# EAGLE schematic BCN3D electronics (EAGLE 7.5.0)
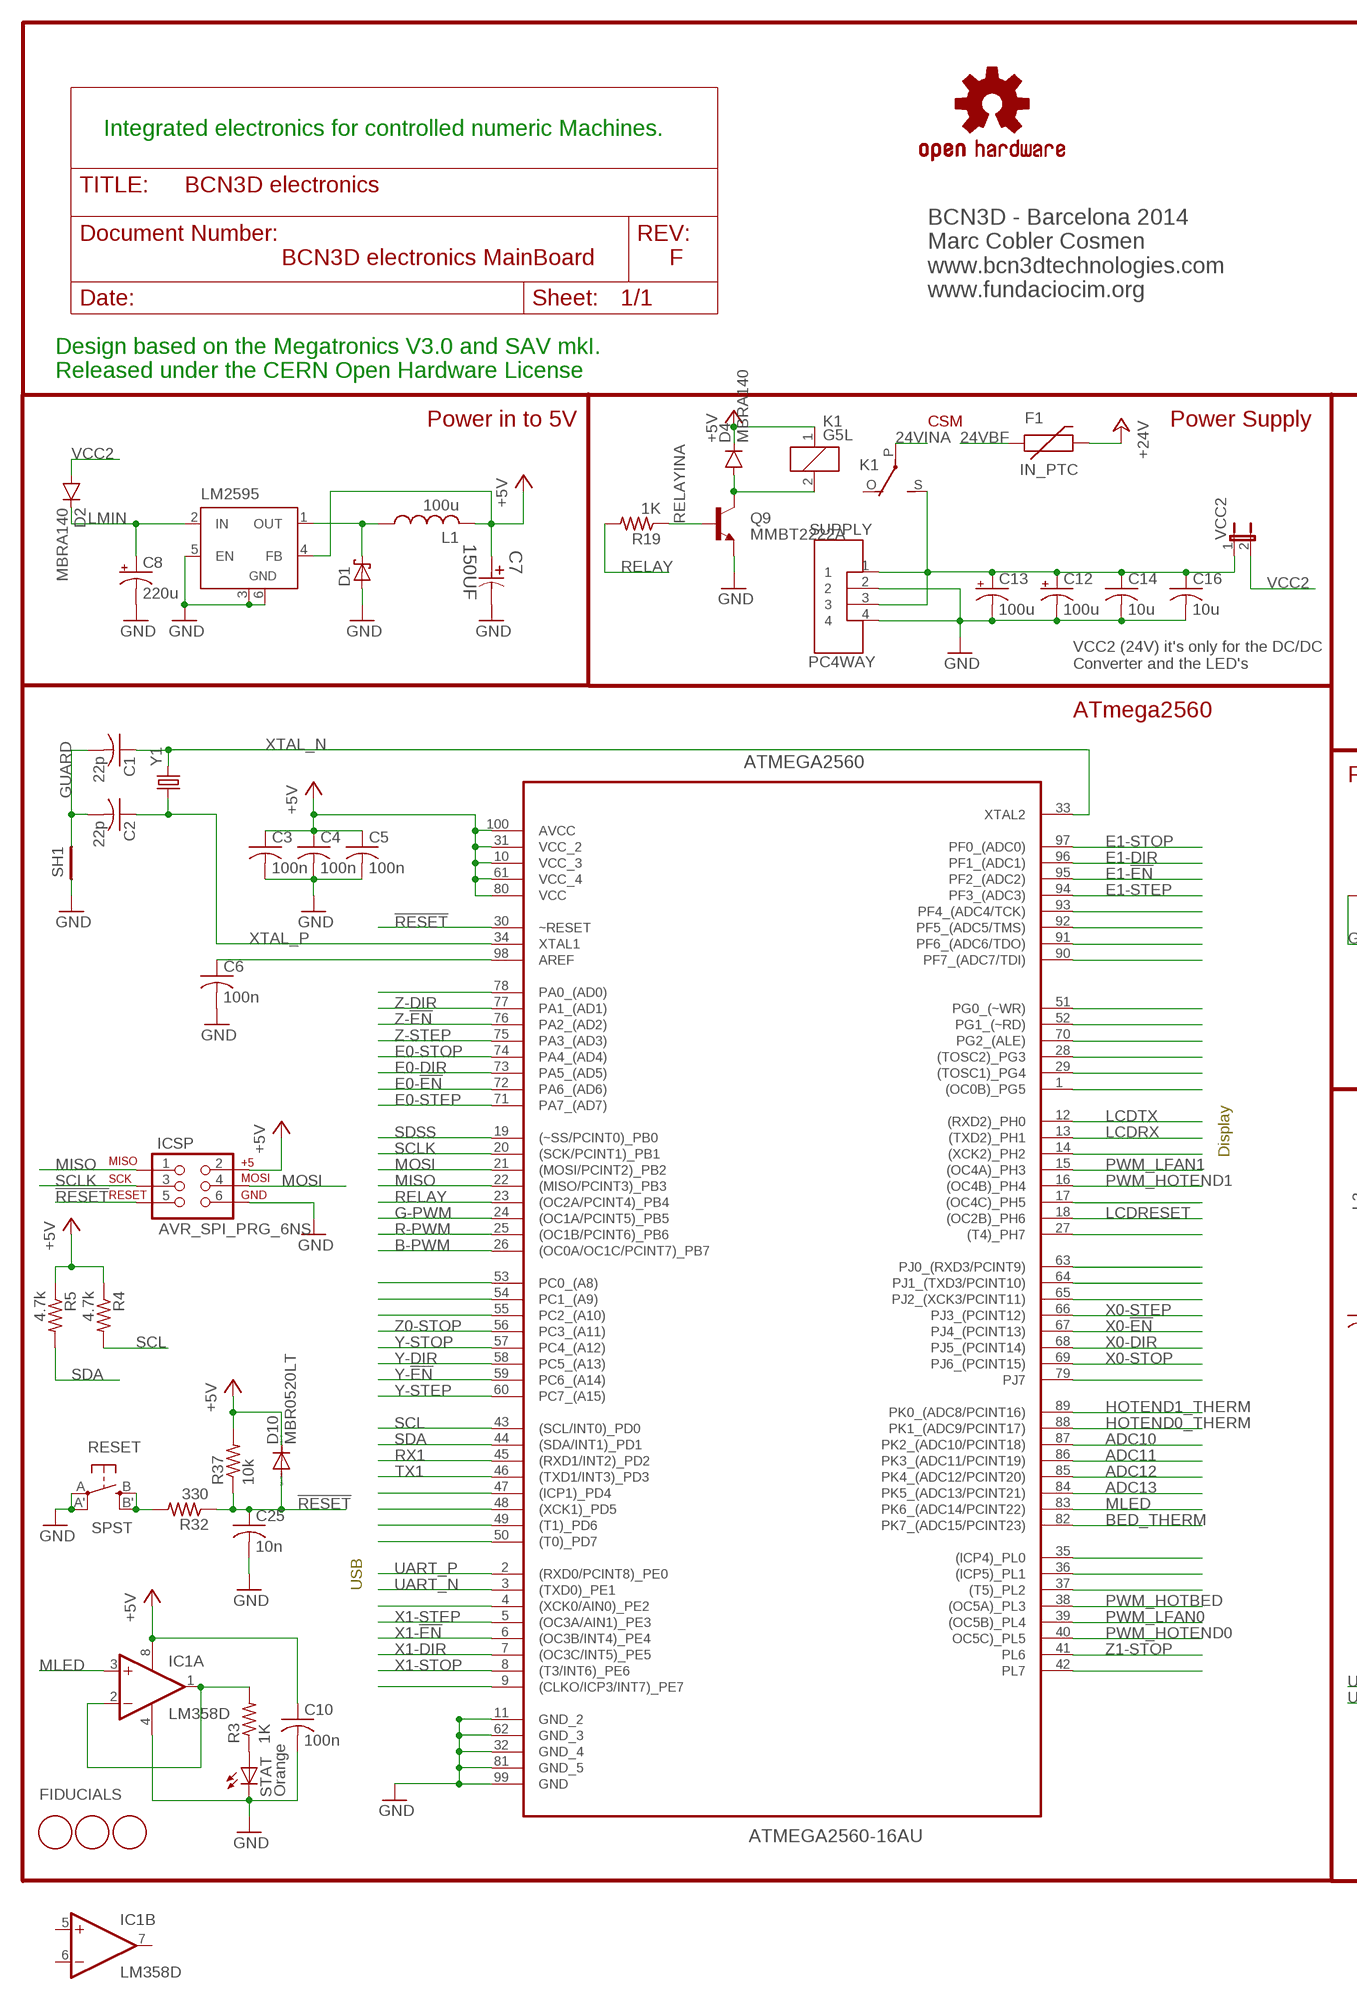
[diagram p0: schematic, sheet 1, part 1 of 2]
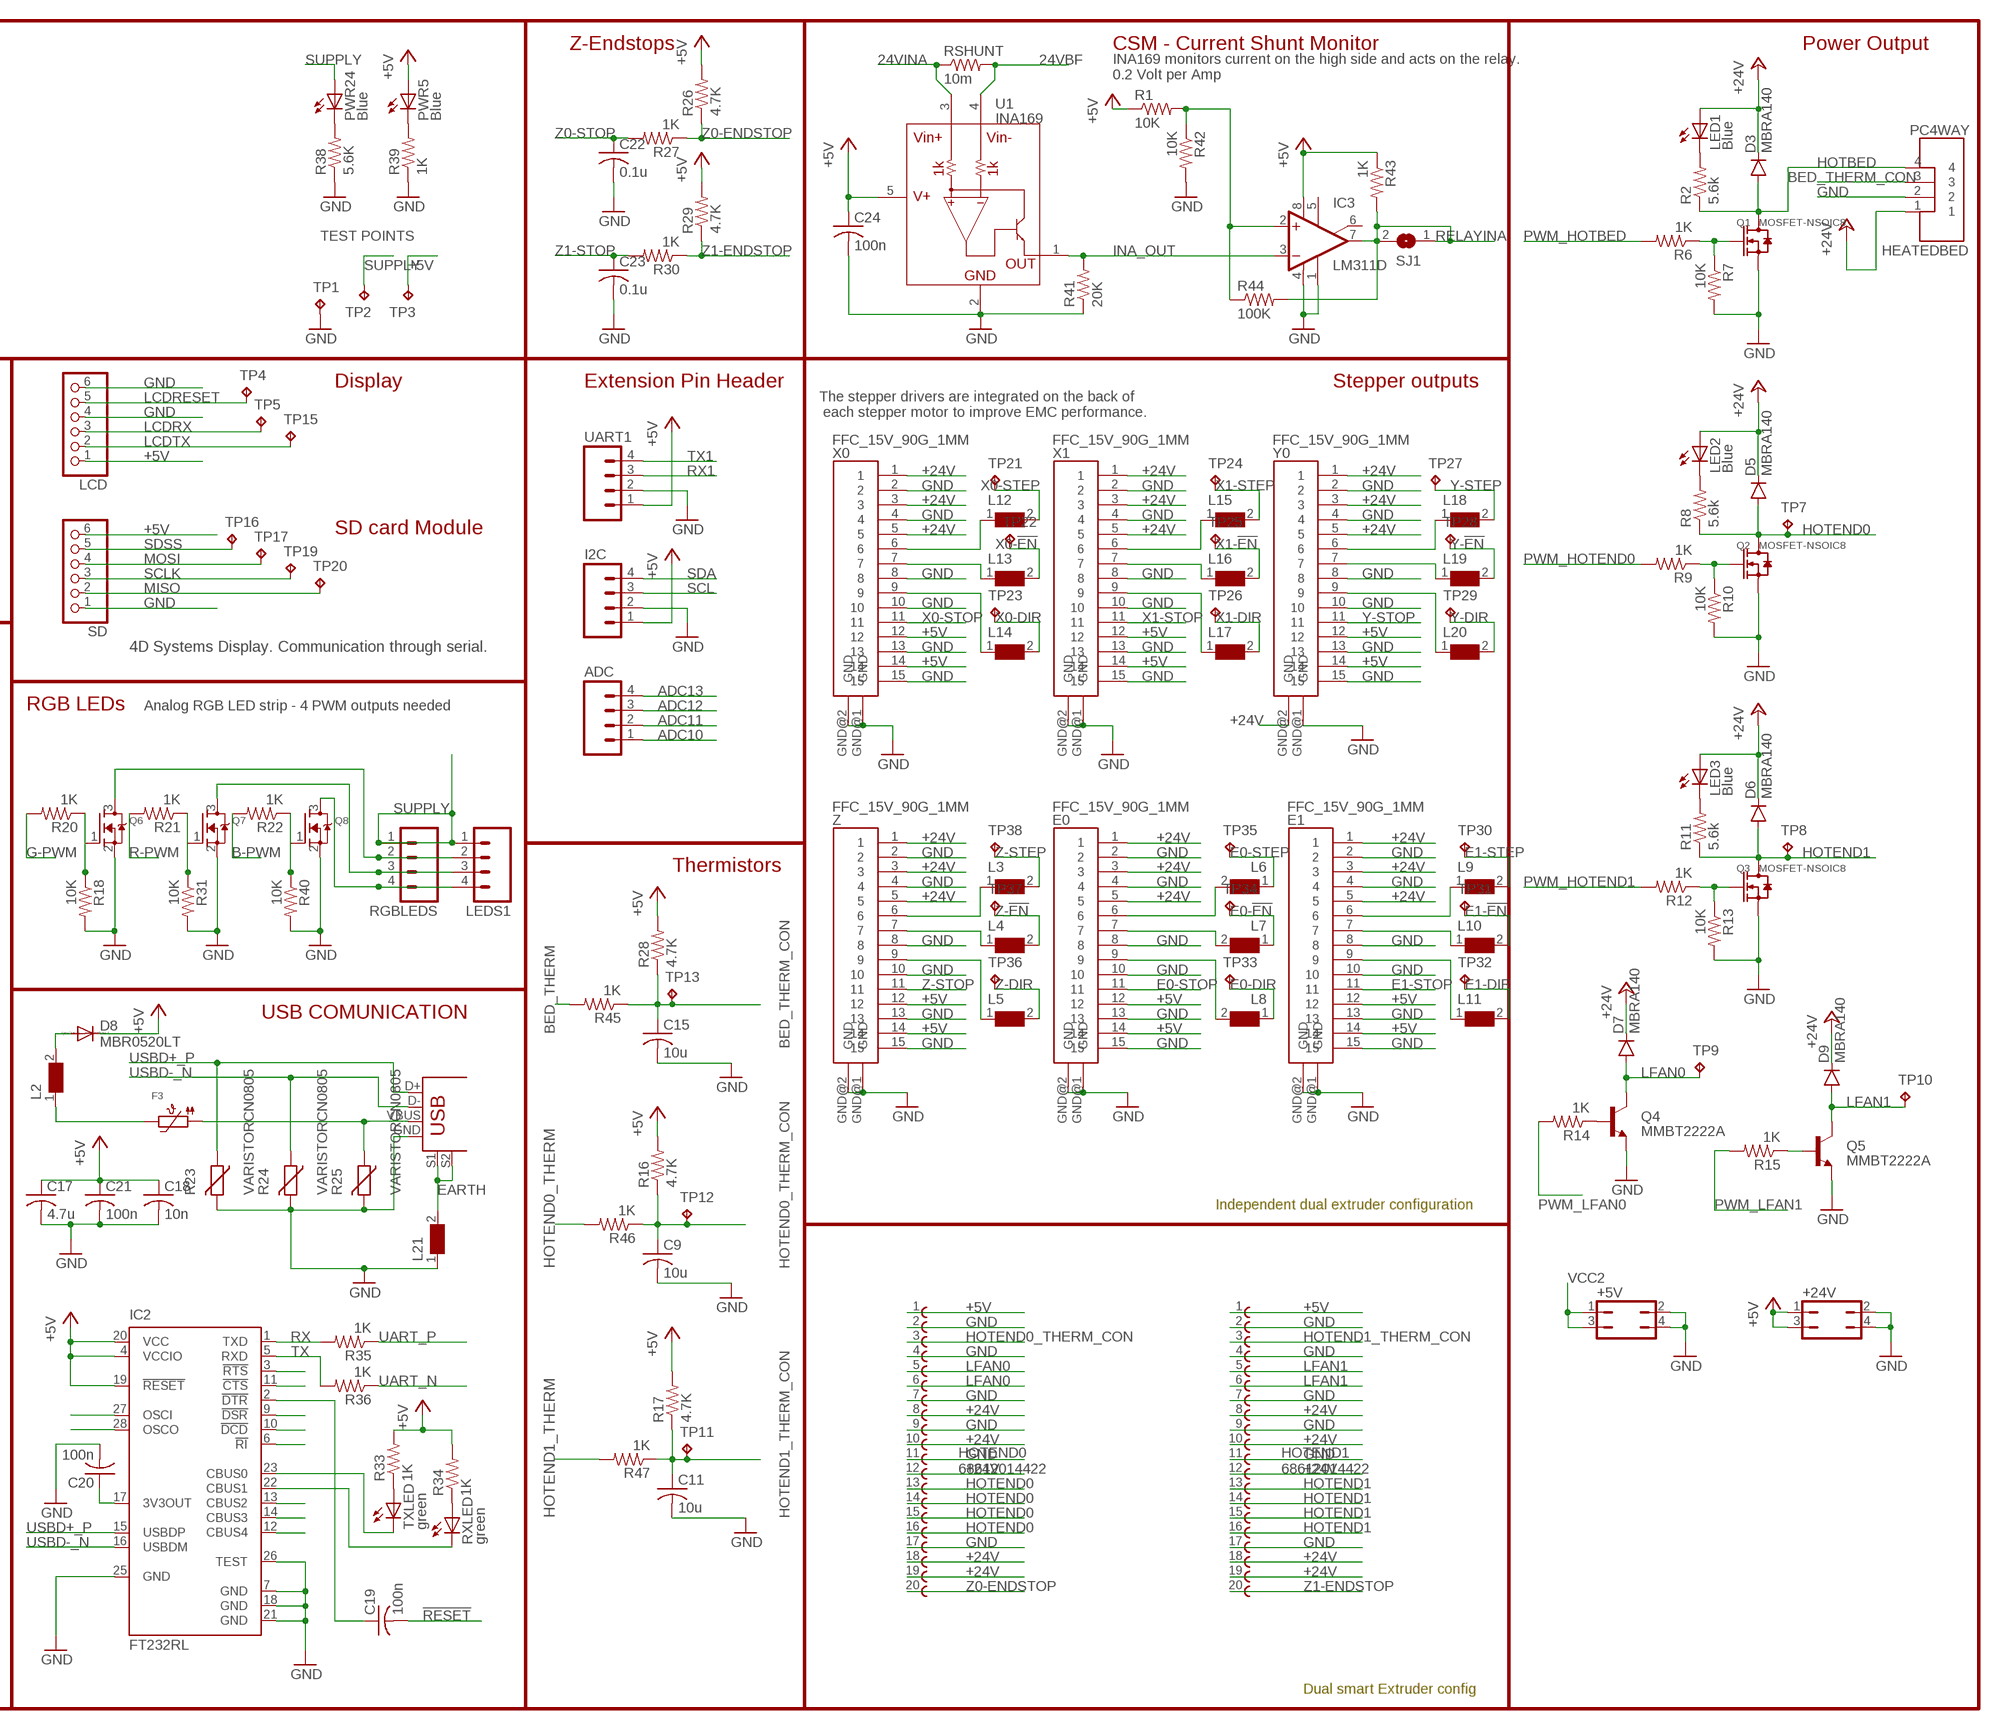
[diagram p1: schematic, sheet 1, part 2 of 2]

## Parts
+5V  JP2Q  [JP2Q]
+24V  JP2Q  [JP2Q]
ADC  M04PTH  [1X04]
ATMEGA2560  ATMEGA2560-16AU  [QFP50P1600X1600X120-100N]
C1  22p  C-USC0805  [C0805]
C2  22p  C-USC0805  [C0805]
C3  100n  C-USC0805  [C0805]
C4  100n  C-USC0805  [C0805]
C5  100n  C-USC0805  [C0805]
C6  100n  C-USC0805  [C0805]
C7  150UF  EEE-FK0J221P-CASE-D  [CAPAE660X610N]
C8  220u  CPOL-USUD-8X10  [UD-8X10_NICHICON]
C9  10u  C-USC0805  [C0805]
C10  100n  C-USC0805  [C0805]
C11  10u  C-USC0805  [C0805]
C12  100u  CPOL-USUD-8X10  [UD-8X10_NICHICON]
C13  100u  CPOL-USUD-8X10  [UD-8X10_NICHICON]
C14  10u  C-USC1210K  [C1210K]
C15  10u  C-USC0805  [C0805]
C16  10u  C-USC1210K  [C1210K]
C17  4.7u  C-USC0805  [C0805]
C18  10n  C-USC0805  [C0805]
C19  100n  C-USC0805  [C0805]
C20  100n  C-USC0805  [C0805]
C21  100n  C-USC0805  [C0805]
C22  0.1u  C-USC0805  [C0805]
C23  0.1u  C-USC0805  [C0805]
C24  100n  C-USC0805  [C0805]
C25  10n  C-USC0805  [C0805]
D1  SCHOTTKY-DIODESMC  [SMC]
D2  MBRA140  DIODESMA  [SMA-DIODE]
D3  MBRA140  DIODESMA  [SMA-DIODE]
D4  MBRA140  DIODESMA  [SMA-DIODE]
D5  MBRA140  DIODESMA  [SMA-DIODE]
D6  MBRA140  DIODESMA  [SMA-DIODE]
D7  MBRA140  DIODESMA  [SMA-DIODE]
D8  MBR0520LT  [SOD123]
D9  MBRA140  DIODESMA  [SMA-DIODE]
D10  MBR0520LT  [SOD123]
E0  FFC_15V_90G_1MM  [TE_FFC_CON1MM]
E1  FFC_15V_90G_1MM  [TE_FFC_CON1MM]
F1  IN_PTC  PTCSMD  [PTC-1206]
F3  MICROBUILDER_PTC1206_L  [MICROBUILDER_1206_PTC]
FID1  FIDUCIAL  [FIDUCIAL_1MM]
FID2  FIDUCIAL  [FIDUCIAL_1MM]
FID3  FIDUCIAL  [FIDUCIAL_1MM]
HEATEDBED  PC4WAY  POWER_CONNECTOR_4WAY  [MOLEX_MINIFIT-JR]
HOTEND0  68612014422  [68612014422]
HOTEND1  68612014422  [68612014422]
I2C  M04PTH  [1X04]
IC1  LM358D  [SO08]
IC2  FT232RL  [SSOP28]
IC3  LM311D  [SO08]
ICSP  AVR_SPI_PRG_6NS  [2X3-NS]
K1  G5L  [G5LE]
L1  100u  INDUCTANCE  [SSR1260]
L2  WE-CBF_0805  [0805]
L3  WE-CBF_0805  [0805]
L4  WE-CBF_0805  [0805]
L5  WE-CBF_0805  [0805]
L6  WE-CBF_0805  [0805]
L7  WE-CBF_0805  [0805]
L8  WE-CBF_0805  [0805]
L9  WE-CBF_0805  [0805]
L10  WE-CBF_0805  [0805]
L11  WE-CBF_0805  [0805]
L12  WE-CBF_0805  [0805]
L13  WE-CBF_0805  [0805]
L14  WE-CBF_0805  [0805]
L15  WE-CBF_0805  [0805]
L16  WE-CBF_0805  [0805]
L17  WE-CBF_0805  [0805]
L18  WE-CBF_0805  [0805]
L19  WE-CBF_0805  [0805]
L20  WE-CBF_0805  [0805]
L21  WE-CBF_0805  [0805]
LCD  PINHD-1X6  [1X06]
LED1  Blue  LEDCHIPLED_0805  [CHIPLED_0805]
LED2  Blue  LEDCHIPLED_0805  [CHIPLED_0805]
LED3  Blue  LEDCHIPLED_0805  [CHIPLED_0805]
LEDS1  M04PTH  [1X04]
LM2595  LM2595  [TO263-5]
LOGO1  OSHW-LOGOM  [OSHW-LOGO-M]
PWR5  Blue  LEDCHIPLED_0805  [CHIPLED_0805]
PWR24  Blue  LEDCHIPLED_0805  [CHIPLED_0805]
Q1  MOSFET-NSOIC8  [SOIC8]
Q2  MOSFET-NSOIC8  [SOIC8]
Q3  MOSFET-NSOIC8  [SOIC8]
Q4  MMBT2222A  TRANSISTOR_NPNMMBT2222A  [SOT23-3]
Q5  MMBT2222A  TRANSISTOR_NPNMMBT2222A  [SOT23-3]
Q6  MOSFET-NREFLOW  [SOT23]
Q7  MOSFET-NREFLOW  [SOT23]
Q8  MOSFET-NREFLOW  [SOT23]
Q9  MMBT2222A  TRANSISTOR_NPNMMBT2222A  [SOT23-3]
R1  10K  R-US_M0805  [M0805]
R2  5.6k  R-US_M0805  [M0805]
R3  1K  R-US_R0805  [R0805]
R4  4.7k  R-US_M0805  [M0805]
R5  4.7k  R-US_M0805  [M0805]
R6  1K  R-US_M0805  [M0805]
R7  10K  R-US_M0805  [M0805]
R8  5.6k  R-US_M0805  [M0805]
R9  1K  R-US_M0805  [M0805]
R10  10K  R-US_M0805  [M0805]
R11  5.6k  R-US_M0805  [M0805]
R12  1K  R-US_M0805  [M0805]
R13  10K  R-US_M0805  [M0805]
R14  1K  R-US_M0805  [M0805]
R15  1K  R-US_M0805  [M0805]
R16  4.7K  R-US_M0805  [M0805]
R17  4.7K  R-US_M0805  [M0805]
R18  10K  R-US_M0805  [M0805]
R19  1K  R-US_M0805  [M0805]
R20  1K  R-US_M0805  [M0805]
R21  1K  R-US_M0805  [M0805]
R22  1K  R-US_M0805  [M0805]
R23  VARISTORCN0805  [CT/CN0805]
R24  VARISTORCN0805  [CT/CN0805]
R25  VARISTORCN0805  [CT/CN0805]
R26  4.7K  R-US_M0805  [M0805]
R27  1K  R-US_M0805  [M0805]
R28  4.7K  R-US_M0805  [M0805]
R29  4.7K  R-US_M0805  [M0805]
R30  1K  R-US_M0805  [M0805]
R31  10K  R-US_M0805  [M0805]
R32  330  R-US_M0805  [M0805]
R33  1K  R-US_M0805  [M0805]
R34  1K  R-US_M0805  [M0805]
R35  1K  R-US_M0805  [M0805]
R36  1K  R-US_M0805  [M0805]
R37  10k  R-US_M0805  [M0805]
R38  5.6K  R-US_R0805  [R0805]
R39  1K  R-US_R0805  [R0805]
R40  10K  R-US_M0805  [M0805]
R41  20K  R-US_M0805  [M0805]
R42  10K  R-US_M0805  [M0805]
R43  1K  R-US_M0805  [M0805]
R44  100K  R-US_M0805  [M0805]
R45  1K  R-US_M0805  [M0805]
R46  1K  R-US_M0805  [M0805]
R47  1K  R-US_M0805  [M0805]
RESET  SPST  SPST_TACT-EVQQ2  [EVQ-Q2]
RGBLEDS  M04PTH  [1X04]
RSHUNT  10m  RESISTOR2512  [R2512]
RXLED  green  LEDCHIPLED_0805  [CHIPLED_0805]
SD  PINHD-1X6  [1X06]
SH1  SHORTT5  [SHORT_TOP-50]
SJ1  SJ  [SJ]
STAT  Orange  LEDCHIP-LED0805  [CHIP-LED0805]
SUPPLY  PC4WAY  POWER_CONNECTOR_4WAY  [MOLEX_MINIFIT-JR]
TP1  TPB2,54  [B2,54]
TP2  TPB2,54  [B2,54]
TP3  TPB2,54  [B2,54]
TP4  TPB2,54  [B2,54]
TP5  TPB2,54  [B2,54]
TP7  TPB2,54  [B2,54]
TP8  TPB2,54  [B2,54]
TP9  TPB2,54  [B2,54]
TP10  TPB2,54  [B2,54]
TP11  TPB2,54  [B2,54]
TP12  TPB2,54  [B2,54]
TP13  TPB2,54  [B2,54]
TP15  TPB2,54  [B2,54]
TP16  TPB2,54  [B2,54]
TP17  TPB2,54  [B2,54]
TP19  TPB2,54  [B2,54]
TP20  TPB2,54  [B2,54]
TP21  TPB2,54  [B2,54]
TP22  TPB2,54  [B2,54]
TP23  TPB2,54  [B2,54]
TP24  TPB2,54  [B2,54]
TP25  TPB2,54  [B2,54]
TP26  TPB2,54  [B2,54]
TP27  TPB2,54  [B2,54]
TP28  TPB2,54  [B2,54]
TP29  TPB2,54  [B2,54]
TP30  TPB2,54  [B2,54]
TP31  TPB2,54  [B2,54]
TP32  TPB2,54  [B2,54]
TP33  TPB2,54  [B2,54]
TP34  TPB2,54  [B2,54]
TP35  TPB2,54  [B2,54]
TP36  TPB2,54  [B2,54]
TP37  TPB2,54  [B2,54]
TP38  TPB2,54  [B2,54]
TXLED  green  LEDCHIPLED_0805  [CHIPLED_0805]
U1  INA169  [SOT23-5]
U$6  USB+SHIELD  [USB-B-PTH]
UART1  M04PTH  [1X04]
VCC2  JP1E  [JP1]
X0  FFC_15V_90G_1MM  [TE_FFC_CON1MM]
X1  FFC_15V_90G_1MM  [TE_FFC_CON1MM]
Y0  FFC_15V_90G_1MM  [TE_FFC_CON1MM]
Y1  CRYSTALHC49US  [HC49US]
Z  FFC_15V_90G_1MM  [TE_FFC_CON1MM]

## Nets
24VBF: F1.1 RSHUNT.2 U1.4(VIN-)
24VINA: K1.P(2:P) RSHUNT.1 U1.3(VIN+)
!RESET: ATMEGA2560.30(~RESET) C19.2 C25.1 D10.A ICSP.5 R32.1 R37.1
+5V: +24V.1 +24V.3 ATMEGA2560.10(VCC_3) ATMEGA2560.31(VCC_2) ATMEGA2560.61(VCC_4) ATMEGA2560.80(VCC) ATMEGA2560.100(AVCC) C3.1 C4.1 C5.1 C7.1 C10.1 C17.1 C18.1 C21.1 C24.1 D4.C D8.C D10.C E0.12 E0.14 E1.12 E1.14 HOTEND0.1 HOTEND1.1 I2C.1 IC1.8(P:V+) IC2.4(VCCIO) IC2.19(!RESET) IC2.20(VCC) IC3.8(V+) ICSP.2 K1.1 L1.B LCD.1 LM2595.4(FB) PWR5.A R1.1 R4.1 R5.1 R16.2 R17.2 R26.2 R28.2 R29.2 R33.2 R34.2 R37.2 R43.1 SD.6 TP3.TP U1.5(V+) UART1.1 X0.12 X0.14 X1.12 X1.14 Y0.12 Y0.14 Z.12 Z.14
+24V: D3.C D5.C D6.C D7.C D9.C E0.1 E0.3 E0.5 E1.1 E1.3 E1.5 F1.2 HEATEDBED.1 HOTEND0.8 HOTEND0.10 HOTEND0.12 HOTEND0.18 HOTEND0.19 HOTEND1.8 HOTEND1.10 HOTEND1.12 HOTEND1.18 HOTEND1.19 LED1.A LED2.A LED3.A X0.1 X0.3 X0.5 X1.1 X1.3 X1.5 Y0.1 Y0.3 Y0.5 Y0.GND@2(GND) Z.1 Z.3 Z.5
ADC10: ADC.1 ATMEGA2560.87(PK2_(ADC10/PCINT18))
ADC11: ADC.2 ATMEGA2560.86(PK3_(ADC11/PCINT19))
ADC12: ADC.3 ATMEGA2560.85(PK4_(ADC12/PCINT20))
ADC13: ADC.4 ATMEGA2560.84(PK5_(ADC13/PCINT21))
B-PWM: ATMEGA2560.26((OC0A/OC1C/PCINT7)_PB7) R22.2
BED_THERM: ATMEGA2560.82(PK7_(ADC15/PCINT23)) R45.2
BED_THERM_CON: C15.1 HEATEDBED.3 R28.1 R45.1 TP13.TP
E0-!EN: ATMEGA2560.72(PA6_(AD6)) L7.1 TP34.TP
E0-DIR: ATMEGA2560.73(PA5_(AD5)) L8.1 TP33.TP
E0-STEP: ATMEGA2560.71(PA7_(AD7)) L6.1 TP35.TP
E0-STOP: ATMEGA2560.74(PA4_(AD4)) E0.11
E1-!EN: ATMEGA2560.95(PF2_(ADC2)) L10.2 TP31.TP
E1-DIR: ATMEGA2560.96(PF1_(ADC1)) L11.2 TP32.TP
E1-STEP: ATMEGA2560.94(PF3_(ADC3)) L9.2 TP30.TP
E1-STOP: ATMEGA2560.97(PF0_(ADC0)) E1.11
EARTH: L21.2 U$6.S1 U$6.S2
G-PWM: ATMEGA2560.24((OC1A/PCINT5)_PB5) R20.2
GND: +5V.2 +5V.4 +24V.2 +24V.4 ATMEGA2560.11(GND_2) ATMEGA2560.32(GND_4) ATMEGA2560.62(GND_3) ATMEGA2560.81(GND_5) ATMEGA2560.99(GND) C3.2 C4.2 C5.2 C6.2 C7.2 C8.- C9.2 C10.2 C11.2 C12.- C13.- C14.2 C15.2 C16.2 C17.2 C18.2 C20.2 C21.2 C22.2 C23.2 C24.2 C25.2 D1.A E0.2 E0.4 E0.8 E0.10 E0.13 E0.15 E0.GND@1(GND) E0.GND@2(GND) E1.2 E1.4 E1.8 E1.10 E1.13 E1.15 E1.GND@1(GND) E1.GND@2(GND) HEATEDBED.2 HOTEND0.2 HOTEND0.4 HOTEND0.7 HOTEND0.9 HOTEND0.11 HOTEND0.17 HOTEND1.2 HOTEND1.4 HOTEND1.7 HOTEND1.9 HOTEND1.11 HOTEND1.17 I2C.2 IC1.4(P:V-) IC2.7(GND) IC2.18(GND) IC2.21(GND) IC2.25(GND) IC2.26(TEST) IC3.1(GND) IC3.4(V-) ICSP.6 L21.1 LCD.4 LCD.6 LM2595.3(GND) LM2595.5(EN) LM2595.6(GND) Q1.1(S) Q1.2(S) Q1.3(S) Q2.1(S) Q2.2(S) Q2.3(S) Q3.1(S) Q3.2(S) Q3.3(S) Q4.2(E) Q5.2(E) Q6.2(S) Q7.2(S) Q8.2(S) Q9.2(E) R7.2 R10.2 R13.2 R18.2 R23.2 R24.2 R25.2 R31.2 R38.1 R39.1 R40.2 R41.1 R42.2 RESET.A'(P1) RESET.A(P) SD.1 SH1.1 STAT.C SUPPLY.2 SUPPLY.4 TP1.TP U1.2(GND) U$6.GND UART1.2 X0.2 X0.4 X0.8 X0.10 X0.13 X0.15 X0.GND@1(GND) X0.GND@2(GND) X1.2 X1.4 X1.8 X1.10 X1.13 X1.15 X1.GND@1(GND) X1.GND@2(GND) Y0.2 Y0.4 Y0.8 Y0.10 Y0.13 Y0.15 Y0.GND@1(GND) Z.2 Z.4 Z.8 Z.10 Z.13 Z.15 Z.GND@1(GND) Z.GND@2(GND)
GUARD: C1.2 C2.2 SH1.2
HOTBED: D3.A HEATEDBED.4 Q1.5(D) Q1.6(D) Q1.7(D) Q1.8(D) R2.1
HOTEND0: D5.A HOTEND0.13 HOTEND0.14 HOTEND0.15 HOTEND0.16 Q2.5(D) Q2.6(D) Q2.7(D) Q2.8(D) R8.1 TP7.TP
HOTEND0_THERM: ATMEGA2560.88(PK1_(ADC9/PCINT17)) R46.2
HOTEND0_THERM_CON: C9.1 HOTEND0.3 R16.1 R46.1 TP12.TP
HOTEND1: D6.A HOTEND1.13 HOTEND1.14 HOTEND1.15 HOTEND1.16 Q3.5(D) Q3.6(D) Q3.7(D) Q3.8(D) R11.1 TP8.TP
HOTEND1_THERM: ATMEGA2560.89(PK0_(ADC8/PCINT16)) R47.2
HOTEND1_THERM_CON: C11.1 HOTEND1.3 R17.1 R47.1 TP11.TP
INA_OUT: IC3.3(-IN) R41.2 U1.1(OUT)
LCDRESET: ATMEGA2560.18((OC2B)_PH6) LCD.5 TP4.TP
LCDRX: ATMEGA2560.13((TXD2)_PH1) LCD.3 TP5.TP
LCDTX: ATMEGA2560.12((RXD2)_PH0) LCD.2 TP15.TP
LFAN0: D7.A HOTEND0.5 HOTEND0.6 Q4.3(C) TP9.TP
LFAN1: D9.A HOTEND1.5 HOTEND1.6 Q5.3(C) TP10.TP
LMIN: C8.+ D2.C LM2595.2(IN)
MISO: ATMEGA2560.22((MISO/PCINT3)_PB3) ICSP.1 SD.2 TP20.TP
MLED: ATMEGA2560.83(PK6_(ADC14/PCINT22)) IC1.3(A:+IN)
MOSI: ATMEGA2560.21((MOSI/PCINT2)_PB2) ICSP.4 SD.4 TP17.TP
N$1: C19.1 IC2.2(!DTR)
N$2: ATMEGA2560.98(AREF) C6.1
N$3: ATMEGA2560.35((ICP4)_PL0)
N$4: ATMEGA2560.14((XCK2)_PH2)
N$5: L12.1 X0.6
N$6: IC2.23(CBUS0) TXLED.C
N$7: IC2.22(CBUS1) RXLED.C
N$8: IC2.3(!RTS)
N$9: LEDS1.2 Q6.3(D) RGBLEDS.2
N$10: LEDS1.3 Q7.3(D) RGBLEDS.3
N$11: LEDS1.4 Q8.3(D) RGBLEDS.4
N$12: IC2.11(!CTS)
N$13: R32.2 RESET.B'(S1) RESET.B(S)
N$14: IC2.9(!DSR)
N$15: IC2.10(!DCD)
N$16: IC2.6(!RI)
N$17: IC2.13(CBUS2)
N$18: IC2.14(CBUS3)
N$19: IC2.12(CBUS4)
N$20: IC2.27(OSCI)
N$21: IC2.28(OSCO)
N$22: ATMEGA2560.47((ICP1)_PD4)
N$23: D8.A L2.2
N$24: ATMEGA2560.78(PA0_(AD0))
N$26: IC1.1(A:OUT) IC1.2(A:-IN) R3.2
N$27: Q6.1(G) R18.1 R20.1
N$28: R3.1 STAT.A
N$29: ATMEGA2560.53(PC0_(A8))
N$31: Q7.1(G) R21.1 R31.1
N$32: Q8.1(G) R22.1 R40.1
N$33: ATMEGA2560.54(PC1_(A9))
N$34: L13.1 X0.7
N$35: L14.1 X0.9
N$36: L18.1 Y0.6
N$37: L19.1 Y0.7
N$38: ATMEGA2560.9((CLKO/ICP3/INT7)_PE7)
N$39: L20.1 Y0.9
N$40: L15.1 X1.6
N$41: L16.1 X1.7
N$42: L17.1 X1.9
N$43: E0.6 L6.2
N$44: E0.7 L7.2
N$45: E0.9 L8.2
N$46: ATMEGA2560.17((OC4C)_PH5)
N$47: ATMEGA2560.55(PC2_(A10))
N$48: F3.2 L2.1
N$49: IC3.2(+IN) R1.2 R42.1 R44.1
N$50: ATMEGA2560.4((XCK0/AIN0)_PE2)
N$54: L3.1 Z.6
N$55: L4.1 Z.7
N$56: L5.1 Z.9
N$57: E1.9 L11.1
N$58: E1.7 L10.1
N$59: E1.6 L9.1
N$63: LED1.C R2.2
N$66: Q1.4(G) R6.1 R7.1
N$69: ATMEGA2560.93(PF4_(ADC4/TCK))
N$73: ATMEGA2560.92(PF5_(ADC5/TMS))
N$74: ATMEGA2560.91(PF6_(ADC6/TDO))
N$75: ATMEGA2560.90(PF7_(ADC7/TDI))
N$76: C20.1 IC2.17(3V3OUT)
N$77: ATMEGA2560.51(PG0_(~WR))
N$78: ATMEGA2560.52(PG1_(~RD))
N$81: R33.1 TXLED.A
N$82: R34.1 RXLED.A
N$83: ATMEGA2560.70(PG2_(ALE))
N$90: Q4.1(B) R14.1
N$91: LED2.C R8.2
N$99: Q2.4(G) R9.1 R10.1
N$100: D4.A K1.2 Q9.3(C)
N$101: ATMEGA2560.28((TOSC2)_PG3)
N$102: LED3.C R11.2
N$103: Q3.4(G) R12.1 R13.1
N$104: ATMEGA2560.48((XCK1)_PD5)
N$105: ATMEGA2560.49((T1)_PD6)
N$106: ATMEGA2560.50((T0)_PD7)
N$107: Q5.1(B) R15.1
N$109: ATMEGA2560.29((TOSC1)_PG4)
N$113: ATMEGA2560.1((OC0B)_PG5)
N$114: ATMEGA2560.63(PJ0_(RXD3/PCINT9))
N$122: ATMEGA2560.64(PJ1_(TXD3/PCINT10))
N$125: ATMEGA2560.27((T4)_PH7)
N$126: ATMEGA2560.65(PJ2_(XCK3/PCINT11))
N$131: ATMEGA2560.79(PJ7)
N$141: ATMEGA2560.36((ICP5)_PL1)
N$142: ATMEGA2560.37((T5)_PL2)
N$147: ATMEGA2560.42(PL7)
N$161: PWR24.C R38.2
N$162: PWR5.C R39.2
OUT: D1.C L1.A LM2595.1(OUT)
PWM_HOTBED: ATMEGA2560.38((OC5A)_PL3) R6.2
PWM_HOTEND0: ATMEGA2560.40(OC5C)_PL5) R9.2
PWM_HOTEND1: ATMEGA2560.16((OC4B)_PH4) R12.2
PWM_LFAN0: ATMEGA2560.39((OC5B)_PL4) R14.2
PWM_LFAN1: ATMEGA2560.15((OC4A)_PH3) R15.2
R-PWM: ATMEGA2560.25((OC1B/PCINT6)_PB6) R21.2
RELAY: ATMEGA2560.23((OC2A/PCINT4)_PB4) R19.2
RELAYINA: IC3.7(OUT) Q9.1(B) R19.1 R43.2 R44.2 SJ1.1 SJ1.2
RX: IC2.1(TXD) R35.2
RX1: ATMEGA2560.45((RXD1/INT2)_PD2) UART1.3
SCL: ATMEGA2560.43((SCL/INT0)_PD0) I2C.3 R4.2
SCLK: ATMEGA2560.20((SCK/PCINT1)_PB1) ICSP.3 SD.3 TP19.TP
SDA: ATMEGA2560.44((SDA/INT1)_PD1) I2C.4 R5.2
SDSS: ATMEGA2560.19((~SS/PCINT0)_PB0) SD.5 TP16.TP
SUPPLY: C12.+ C13.+ C14.1 C16.1 K1.S(2:S) LEDS1.1 PWR24.A RGBLEDS.1 SUPPLY.1 SUPPLY.3 TP2.TP VCC2.1
TX: IC2.5(RXD) R36.2
TX1: ATMEGA2560.46((TXD1/INT3)_PD3) UART1.4
UART_N: ATMEGA2560.3((TXD0)_PE1) R36.1
UART_P: ATMEGA2560.2((RXD0/PCINT8)_PE0) R35.1
USBD+_P: IC2.15(USBDP) R23.1 U$6.D+
USBD-_N: IC2.16(USBDM) R24.1 U$6.D-
VBUS: F3.1 R25.1 U$6.VBUS
VCC2: +5V.1 +5V.3 D2.A VCC2.2
X0-!EN: ATMEGA2560.67(PJ4_(PCINT13)) L13.2 TP22.TP
X0-DIR: ATMEGA2560.68(PJ5_(PCINT14)) L14.2 TP23.TP
X0-STEP: ATMEGA2560.66(PJ3_(PCINT12)) L12.2 TP21.TP
X0-STOP: ATMEGA2560.69(PJ6_(PCINT15)) X0.11
X1-!EN: ATMEGA2560.6((OC3B/INT4)_PE4) L16.2 TP25.TP
X1-DIR: ATMEGA2560.7((OC3C/INT5)_PE5) L17.2 TP26.TP
X1-STEP: ATMEGA2560.5((OC3A/AIN1)_PE3) L15.2 TP24.TP
X1-STOP: ATMEGA2560.8((T3/INT6)_PE6) X1.11
XTAL_N: ATMEGA2560.33(XTAL2) C1.1 Y1.2
XTAL_P: ATMEGA2560.34(XTAL1) C2.1 Y1.1
Y-!EN: ATMEGA2560.59(PC6_(A14)) L19.2 TP28.TP
Y-DIR: ATMEGA2560.58(PC5_(A13)) L20.2 TP29.TP
Y-STEP: ATMEGA2560.60(PC7_(A15)) L18.2 TP27.TP
Y-STOP: ATMEGA2560.57(PC4_(A12)) Y0.11
Z0-ENDSTOP: HOTEND0.20 R26.1 R27.1
Z0-STOP: ATMEGA2560.56(PC3_(A11)) C22.1 R27.2
Z1-ENDSTOP: HOTEND1.20 R29.1 R30.1
Z1-STOP: ATMEGA2560.41(PL6) C23.1 R30.2
Z-!EN: ATMEGA2560.76(PA2_(AD2)) L4.2 TP37.TP
Z-DIR: ATMEGA2560.77(PA1_(AD1)) L5.2 TP36.TP
Z-STEP: ATMEGA2560.75(PA3_(AD3)) L3.2 TP38.TP
Z-STOP: Z.11
Unconnected: IC1.5(B:+IN) IC1.6(B:-IN) IC1.7(B:OUT) IC3.5(ON) IC3.6(ON/STR) K1.O(2:O)

## Notes on the sheet
- Z-Endstops | CSM - Current Shunt Monitor | Power Output
- INA169 monitors current on the high side and acts on the relay.
  0.2 Volt per Amp
- Integrated electronics for controlled numeric Machines.
- BCN3D electronics MainBoard | F | TEST POINTS
- BCN3D - Barcelona 2014
  Marc Cobler Cosmen
  www.bcn3dtechnologies.com
  www.fundaciocim.org
- Design based on the Megatronics V3.0 and SAV mkI.
  Released under the CERN Open Hardware License
- Power in to 5V | CSM | Power Supply | Display | Extension Pin Header | Stepper outputs
- The stepper drivers are integrated on the back of
   each stepper motor to improve EMC performance.
- SD card Module
- VCC2 (24V) it's only for the DC/DC
  Converter and the LED's
- ATmega2560 | 4D Systems Display. Communication through serial.
- RGB LEDs | Analog RGB LED strip - 4 PWM outputs needed
- Thermistors
- Display
- USB COMUNICATION
- Independent dual extruder configuration
- USB
- FIDUCIALS
- Dual smart Extruder config

## Library data of the parts
+5V +24V = jumper:JP2Q: JUMPER; OC_FARNELL: unknown
ADC I2C LEDS1 RGBLEDS UART1 = SparkFun-Connectors:M04: Header 4 Standard 4-pin 0.1" header. Use with straight break away headers (SKU : PRT-00116), right angle break away headers (PRT-00553), swiss pins (PRT-00743), machine pins (PRT-00117), and female headers (PRT-00115). Molex polarized connector foot print use with SKU : PRT-08231 with associated crimp pins and housings. 1MM SMD Version SKU: PRT-10208; OC_FARNELL: unknown
ATMEGA2560 = Atmel_By_element14_Batch_1-00:ATMEGA2560-16AU: Microcontroller; DESCRIPTION: Microcontroller; MF: ATMEL; MPN: ATMEGA2560-16AU; OC_FARNELL: 1288330; OC_NEWARK: 23M5051; PACKAGE: LQFP-100; SUPPLIER: ATMEL
C1 C2 = resistor:C-US: CAPACITOR, American symbol; MF: AVX; MPN: 08055A220KAT2A; OC_FARNELL: 2332763
C3-C6 C9-C11 C15 C19 C20 C22 C23 = rcl:C-US: CAPACITOR, American symbol; MF: AVX; MPN: 08055C104KAT2A; OC_FARNELL: 499687
C7 = MarcEagleParts:EEE-: Aluminum Electrolytic Capacitors,Surface Mount Type; MF: PANASONIC ELECTRONIC COMPONENTS; MPN: EEEFP1A151AP; OC_FARNELL: 1539463; OC_NEWARK: 23T0833; PACKAGE: CASE-D; SUPPLIER: PANASONIC; TOLERANCE: ±20 %; VALUE: 220UF; VOLTAGERATING: 6.3V
C8 = rcl:CPOL-US: POLARIZED CAPACITOR, American symbol; MF: PANASONIC ELECTRONIC COMPONENTS; MPN: EEE1VA221UAP; OC_FARNELL: 2326175
C12 C13 = rcl:CPOL-US: POLARIZED CAPACITOR, American symbol; MF: PANASONIC ELECTRONIC COMPONENTS; MPN: EEEFC1V101AP; OC_FARNELL: 1244377
C14 C16 = rcl:C-US: CAPACITOR, American symbol; MF: MURATA; MPN: GRM32ER7YA106KA12L; OC_FARNELL: 1735537
C17 = adafruit:C-US: CAPACITOR, American symbol; MF: AVX; MPN: 06035C103JAT2A; OC_FARNELL: 1833871
C18 = adafruit:C-US: CAPACITOR, American symbol; MF: AVX; MPN: 08055C103KAT2A; OC_FARNELL: 499225
C21 C24 = adafruit:C-US: CAPACITOR, American symbol; MF: AVX; MPN: 08055C104KAT2A; OC_FARNELL: 499687
C25 = rcl:C-US: CAPACITOR, American symbol; MF: AVX; MPN: 08055C103KAT2A; OC_FARNELL: 499225
D1 = diode:SCHOTTKY-DIODE: Schottky Diode; MF: ON SEMICONDUCTOR; MPN: MBRS340T3G; OC_FARNELL: 9557377
D2-D7 D9 = SparkFun-DiscreteSemi:DIODE: Diode These are standard reverse protection diodes and small signal diodes. SMA package can handle up to about 1A. SOD-323 can handle about 200mA. What the SOD-323 package when ordering, there are some mfgs out there that are 5-pin packages.; MF: DIODES INC.; MPN: B140-13-F; OC_FARNELL: 1843670
D8 D10 = diode:MBR0520LT: SCHOTTKY BARRIER RECTIFIER Source: http://onsemi.com .. MBR0520LT1-D.pdf; MF: PANASONIC ELECTRONIC COMPONENTS; MPN: DA22F2100L; OC_FARNELL: 2284096
E0 E1 X0 X1 Y0 Z = MarcEagleParts:FFC_15V_90G_1MM; OC_FARNELL: unknown
F1 = SparkFun-PowerIC:PTC: Resettable Fuse PTC Resettable Fuse. Spark Fun Electronics SKU : COM-08357; MF: SCHURTER; MPN: 3413.0329.22; OC_FARNELL: 1829472; PROD_ID: RES-11150
F3 = SAV MK-I:MICROBUILDER_PTC: PTC (Resettable Fuse) 1206 Package 250mA PTC (16V Max, Time-to-Trip: 0.08s) - Digikey: F2110CT-ND 1210 Package 100mA PTC (30V Max, Time-to-Trip: 0.6s) - Digikey: MF-USMF010-2CT-ND 1812 Package 750mA PTC (24V Max, Time-to-Trip: 0.2s) - Digikey: MF-MSMF075/24-2CT-ND; MF: LITTELFUSE; MPN: 1206L050YR; OC_FARNELL: 1596993
FID1-FID3 = adafruit:FIDUCIAL: For use by pick and place machines to calibrate the vision/machine, 1mm By microbuilder.eu; OC_FARNELL: unknown
HEATEDBED SUPPLY = MarcEagleParts:POWER_CONNECTOR_4WAY: MOLEX Mini-Fit Jr. 13A/600V Power connector REF: 39303045 Farnell --> 9963553; MF: MOLEX; MPN: 39303045; OC_FARNELL: 9963553
HOTEND0 HOTEND1 = FPC_FFC_Connectors_:68612014422: WR-FPC 1.00mm SMT ZIF Horizontal Bottom Contact, 20 Pins=>Code : Con_FPC_ZIF_1.00_68612014422 <http://katalog.we-online.de/media/images/eican/Con_FPC_ZIF_1.00_6861xx14422_pf2.jpg> Details see: http://katalog.we-online.de/en/em/686_1xx_144_22 Created 2014-07-09, Karrer Zheng 2014 (C) Würth Elektronik; OC_FARNELL: unknown
IC1 = linear:LM358: OP AMP also LM158; LM258; LM2904 Source: http://cache.national.com/ds/LM/LM158.pdf; MF: STMICROELECTRONICS; MPN: LM2904DT; OC_FARNELL: 1564327
IC2 = ftdichip:FT232R: Source: http://www.ftdichip.com/Documents/DataSheets/DS_FT232R_v104.pdf; MF: FTDI; MPN: FT232RL; OC_FARNELL: 1146032; OC_NEWARK: 91K9918
IC3 = linear:LM311: COMPARATOR
ICSP = SparkFun-Connectors:AVR_SPI_PRG_6: AVR ISP 6 Pin This is the reduced ISP connector for AVR programming. Common on Arduino. This footprint will take up less PCB space and can be used with a 10-pin to 6-pin adapter such as SKU: BOB-08508 **Special note about "TEST_POINT" package. The stop mask is on the top side, so if you want your programming test points to be on the bottom of your board, make sure to place this package on the bottom side of the board. This also ensure that the orientation to program from the bottom side will be correct.; OC_FARNELL: unknown
K1 = relay:G5L: RELAY 1 x switch, 10 A/120 V AC, 8 A/30 V ADC, Omron; MF: OMRON ELECTRONIC COMPONENTS; MPN: G5LA-1 5DC; OC_FARNELL: 1455502; OC_NEWARK: unknown
L1 = MarcEagleParts:INDUCTANCE: INDUCTOR, American symbol; MF: BOURNS; MPN: SRR1260-101M; OC_FARNELL: 2396102
L2-L21 = EagleLibrary_Wuerth_Elektronik_eiSos_V6_20140807:WE-CBF: SMD EMI Suppression Ferrite Beads WE-CBF - Excellent anti-EMI properties - Low DC-restistance - Impedances till 3000 ohms - Rated current up to 6 A -- Reliable Ni-Sn electrodes -- Perfect as data lined filter and for uncoupling of distribution voltage <http://katalog.we-online.de/media/images/eisos/FeCBF_pf2.jpg> Details see: http://katalog.we-online.de/en/pbs/WE-CBF updated by Dan Xu 2014-06-19 2014 (C) Würth Elektronik; OC_FARNELL: unknown
LCD SD = pinhead:PINHD-1X6: PIN HEADER; OC_FARNELL: unknown
LED1-LED3 PWR5 PWR24 = led:LED: LED; MF: MULTICOMP; MPN: OVS-0803; OC_FARNELL: 1716765
LM2595 = MarcEagleParts:LM2595: STEP-DOWN VOLTAGE REGULATOR; MF: TEXAS INSTRUMENTS; MPN: LM2595S-5.0/NOPB; OC_FARNELL: 1469193
LOGO1 = SparkFun-Aesthetics:OSHW-LOGO: Open Source Hardware Logo This logo indicates the piece of hardware it is found on incorporates a OSHW license and/or adheres to the definition of open source hardware found here: http://freedomdefined.org/OSHW; OC_FARNELL: unknown
Q1-Q3 = MarcEagleParts:MOSFET-N: CJ2302：SMD MOSFET N-CH 20V-2.1A; MF: INTERNATIONAL RECTIFIER; MPN: IRF8736PBF; OC_FARNELL: 1551903
Q4 Q5 Q9 = SparkFun-DiscreteSemi:TRANSISTOR_NPN: Generic NPN BJT MMBT2222A - TRANS-08049 (SOT-23, 1A 40V) MPSA42 - TRANS-09116 (SOT-23, 500mA 300V) MMBT5088LT1G - TRANS-11160 (SOT-23, 50 mA 30V) BC547 - COM-08928 <http://www.sparkfun.com/products/8928> (TO-92 45V 100mA) (1.Collector 2.Base 3.Emitter) 2N3904 - COM-00521 <http://www.sparkfun.com/products/521> (TO-92 40V 200mA) (1.Emitter 2.Base 3.Collector) P2N2222A - COM-12852 <http://www.sparkfun.com/products/12852> (TO-92 40V 600mA) (1.Collector 2.Base 3.Emitter); MF: NXP; MPN: BC817-40; OC_FARNELL: 1081225; PROD_ID: TRANS-08049
Q6-Q8 = adafruit:MOSFET-N: N-Channel Mosfet 2N7002E - 60V 260mA SOT23 [Digikey: 2N7002ET1GOSTR-ND] - REEL BSH103 - 30V 850mA SOT23 [Digikey: 568-5013-1-ND]; MF: NXP; MPN: BSH103,215; OC_FARNELL: 1081307
R1-R3 R6 R8 R9 R11 R12 R14 R15 R18-R22 R27 R30 R31 R33-R36 R39 R40 R42-R44 = rcl:R-US_: RESISTOR, American symbol; MF: BOURNS; MPN: CR0805-JW-102ELF; OC_FARNELL: 2008389
R4 R5 R7 R10 R13 = rcl:R-US_: RESISTOR, American symbol; MF: BOURNS; MPN: CR0805-JW-103ELF; OC_FARNELL: 2008390
R16 R17 R26 R28 R29 R38 R41 R45-R47 = rcl:R-US_: RESISTOR, American symbol; MF: BOURNS; MPN: CR0805-FX-4701GLF; OC_FARNELL: 2008383
R23-R25 = varistor:VARISTOR: VARISTOR; MF: LITTELFUSE; MPN: V5.5MLA0805LH; OC_FARNELL: 1057218
R32 R37 = adafruit:R-US_: RESISTOR, American symbol; MF: BOURNS; MPN: CR0805-JW-103ELF; OC_FARNELL: 2008390
RESET = adafruit:SPST_TACT: SMT 6mm switch, EVQQ2 series http://www.ladyada.net/library/eagle; MF: PANASONIC ELECTRONIC COMPONENTS; MPN: EVQQ2503W; OC_FARNELL: 9962913
RSHUNT = SparkFun-Resistors:RESISTOR: Resistor Basic schematic elements and footprints for 0603, 1206, and PTH resistors.
RXLED TXLED = led:LED: LED; MF: WURTH ELEKTRONIK; MPN: 150080VS75000; OC_FARNELL: 2322081
SH1 = shorts:SHORT: Short between two nets; BOM: no; OC_FARNELL: unknown
SJ1 = jumper:SJ: SMD solder JUMPER
STAT = adafruit:LED: LED; MF: KINGBRIGHT; MPN: KP-2012SECK; OC_FARNELL: 2290332
TP1-TP5 TP7-TP13 TP15-TP17 TP19-TP38 = testpad:TP: Test pad; OC_FARNELL: unknown
U1 = SparkFun-AnalogIC:INA169
U$6 = SparkFun-Connectors:USB+SHIELD: USB+Shield USB connector with shield pins connectable; MF: MOLEX; MPN: 67068-8000; OC_FARNELL: 1463095
VCC2 = jumper:JP1E: JUMPER; OC_FARNELL: unknown
Y1 = SparkFun-FreqCtrl:CRYSTAL: Various standard crystals. Proven footprints.; MF: TXC; MPN: 9B-16.000MAAJ-B; OC_FARNELL: 1842216